# Altium schematic sheet inertial-st.SchDoc
size A4
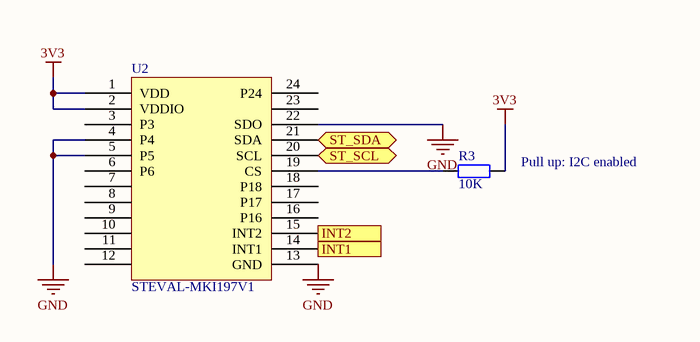
[diagram p0: inertial-st.SchDoc]

## Parts
R3  10K  [FP_0805_RES]
U2  STEVAL-MKI197V1  [STEVAL-MKI160V1]

## Ports
INT1 (out), INT2 (out), ST_SCL (bidir), ST_SDA (bidir)

## Nets
3V3: R3.2 U2.1(VDD) U2.2(VDDIO)
GND: U2.4(P4) U2.5(P5) U2.13(GND) U2.22(SDO)
INT1: U2.14(INT1) ; port INT1
INT2: U2.15(INT2) ; port INT2
ST_SCL: U2.20(SCL) ; port ST_SCL
ST_SDA: U2.21(SDA) ; port ST_SDA
NetR3_1: R3.1 U2.19(CS)

Not connected (* = marked no-connect by the designer): U2 3(P3) 6(P6) 7 8 9 10 11 12 16(P16) 17(P17) 18(P18) 23 24(P24)

## Notes on the sheet
- (near R3) Pull up: I2C enabled

## Library data of the parts
R3 = RES: Resistor; Value: 10K